# EAGLE board Type-C Test Fixture (TPS65987D)_v2 (EAGLE 9.6.1), part 1 of 2
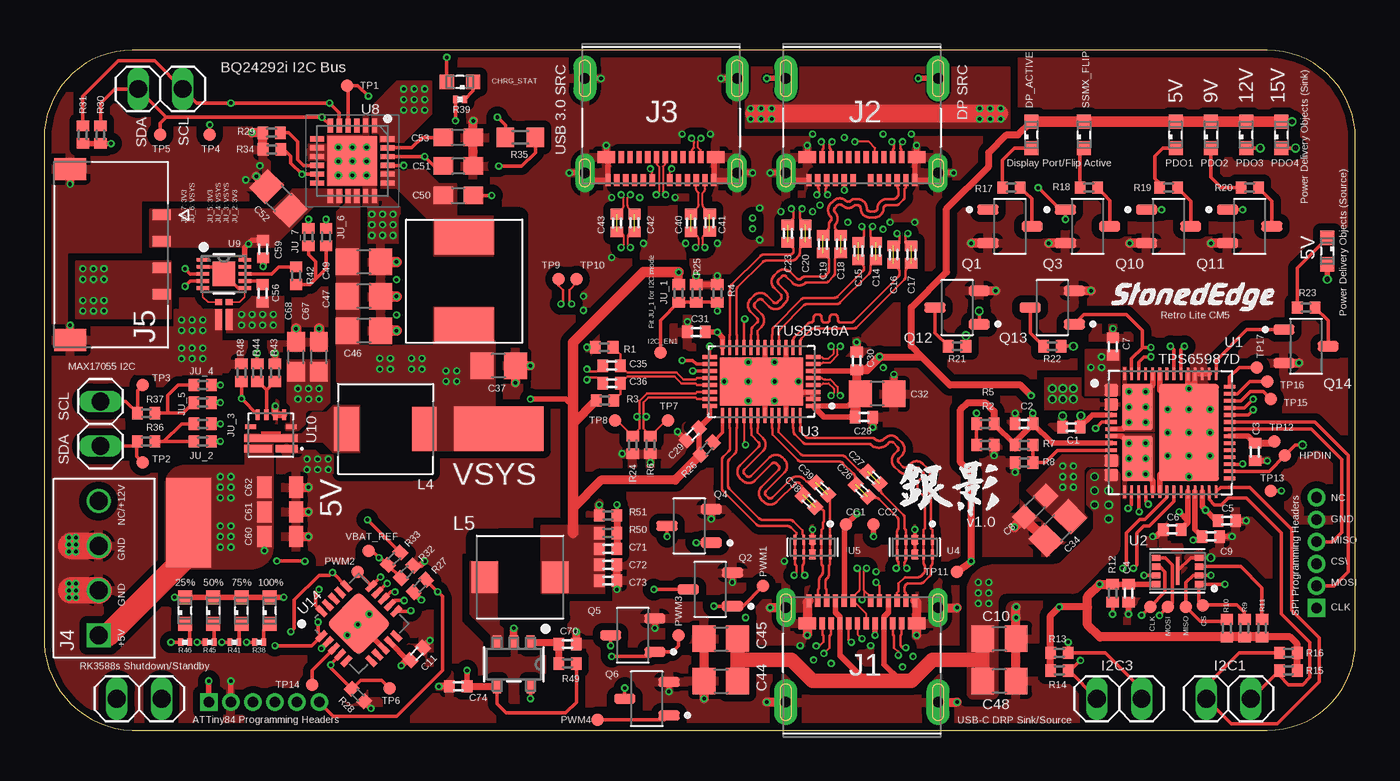
[diagram p2: board, top side]
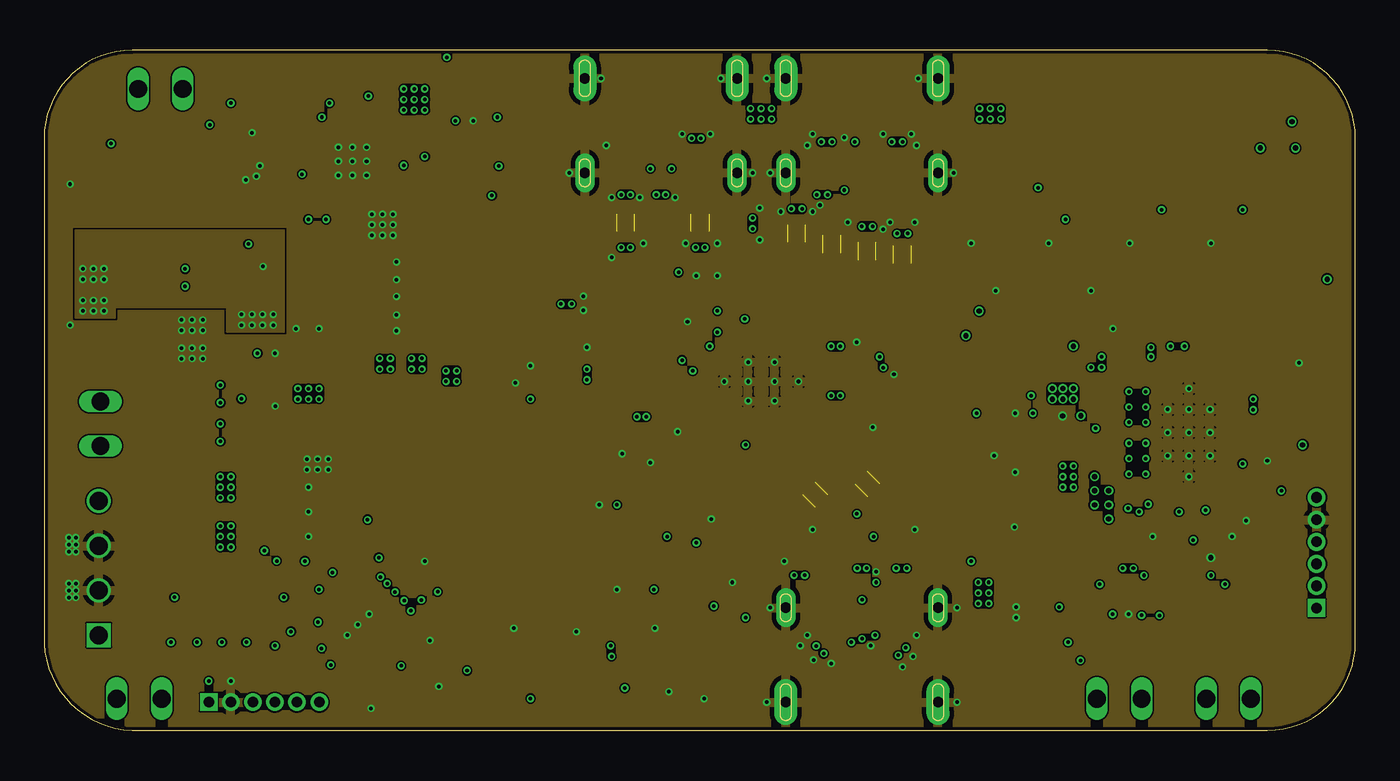
[diagram p3: board, inner layer GND1]
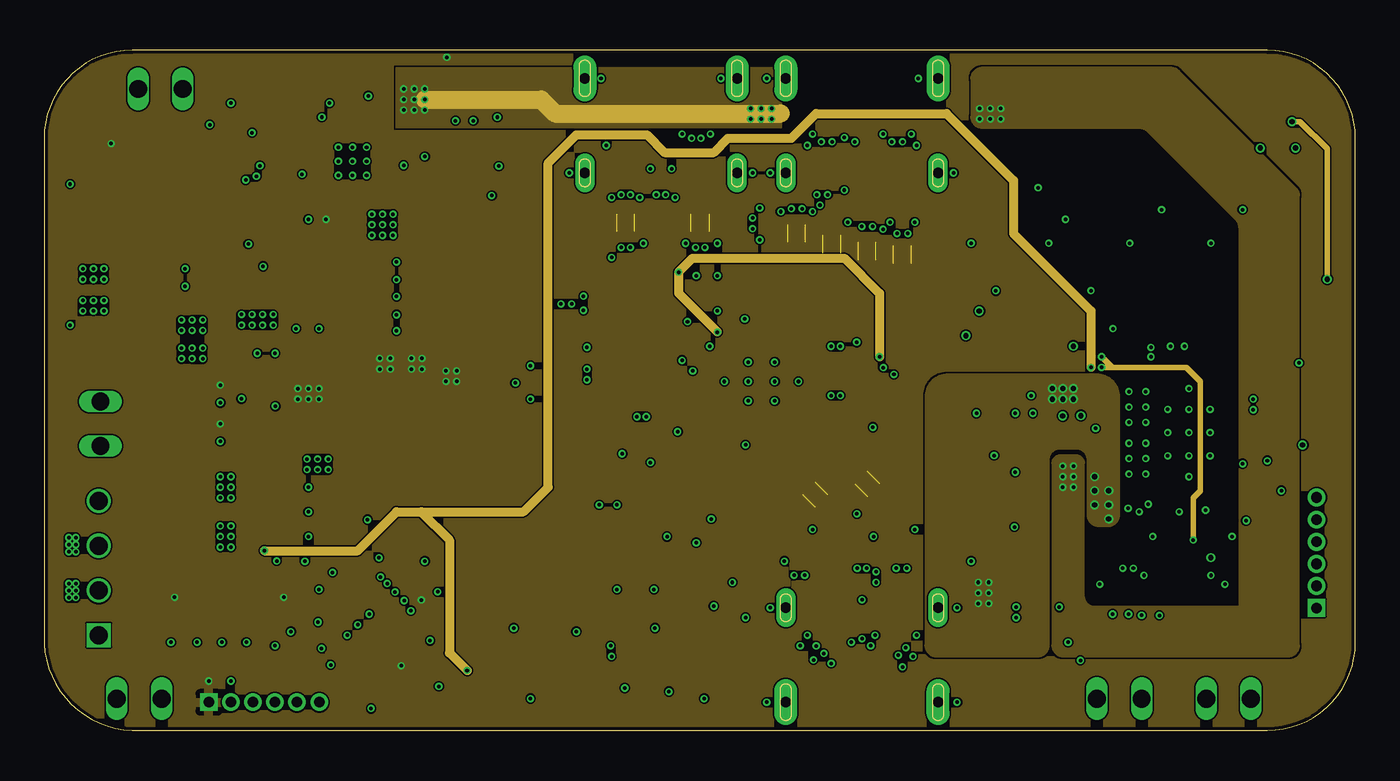
[diagram p4: board, inner layer POWER1]
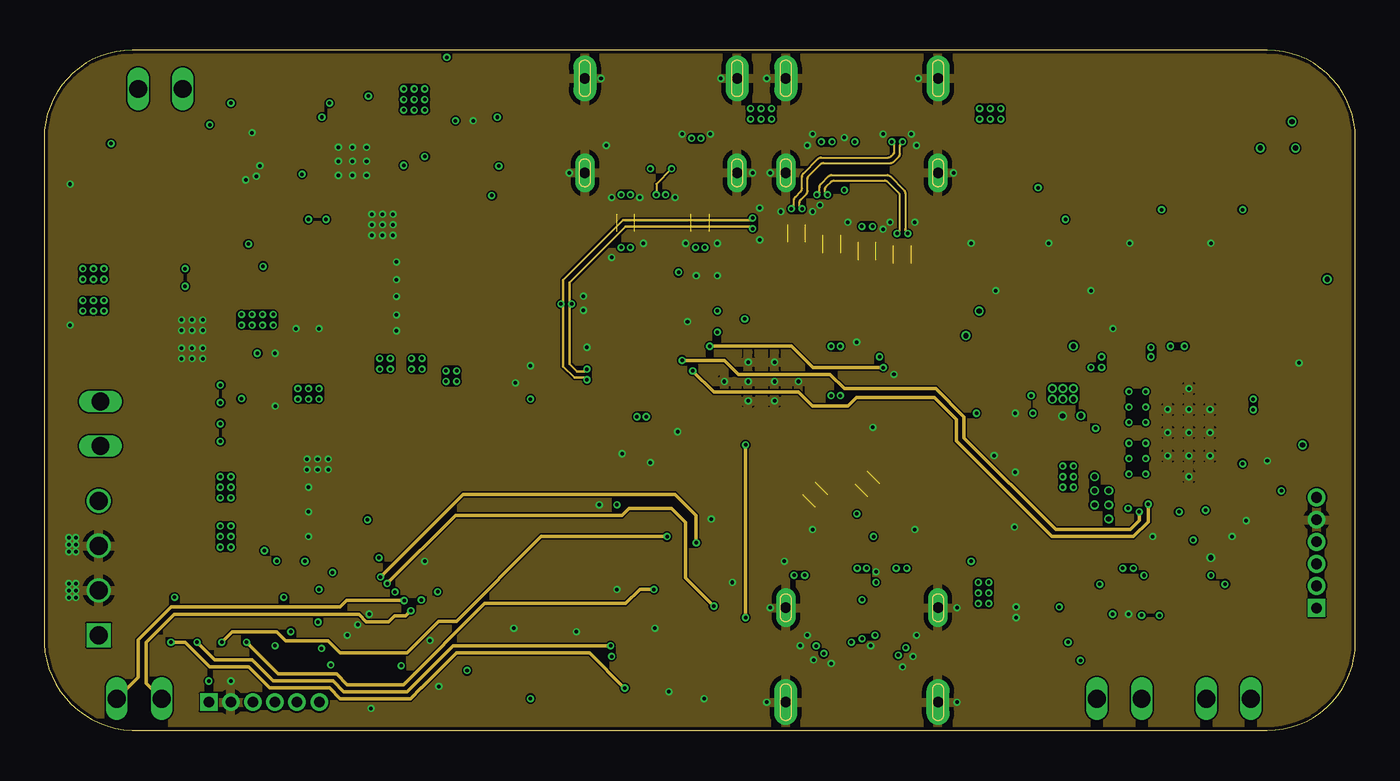
[diagram p5: board, inner layer SIGNAL2]
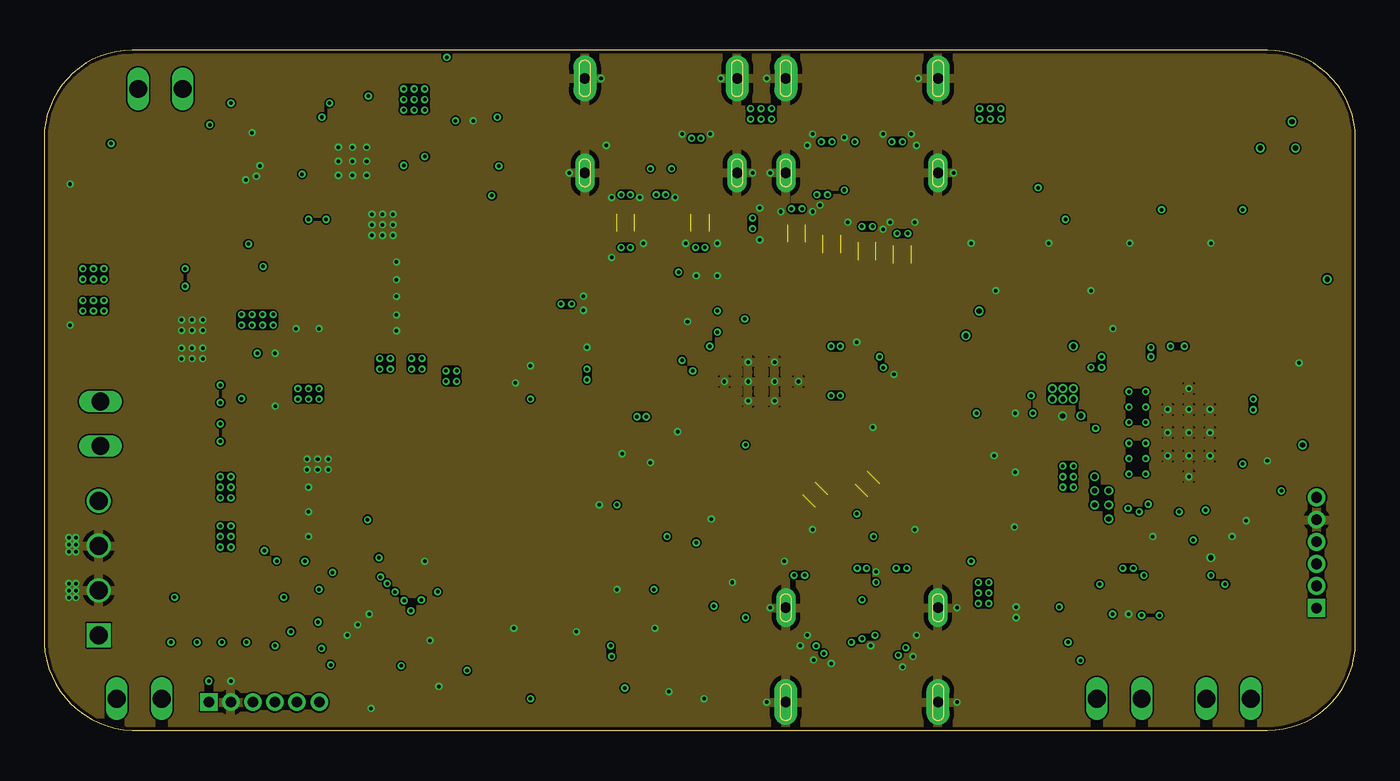
[diagram p6: board, inner layer GND2]
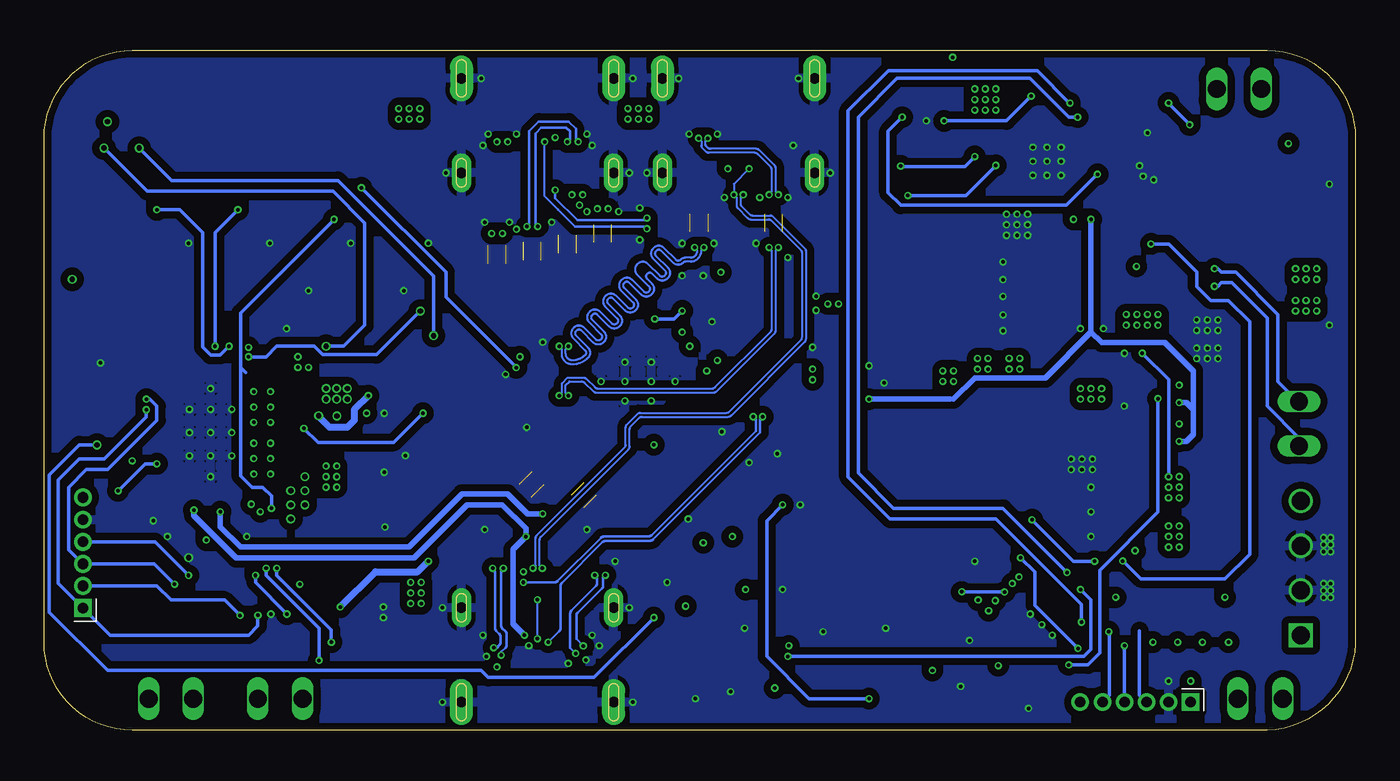
[diagram p7: board, bottom side, seen from below]

Size 74.4 x 38.6 mm. Coordinates in mm from the lower left corner, seen from the top.
Outline: 0,33.6 0,5.4 arc90 5,0 69.4,0 arc90 74.4,5 74.4,33.6 arc90 69.4,38.6 5,38.6 arc90 0,33.6
Copper layers (1+2*3+14*15+16): SIGNAL1 0.035mm / dielectric 0.1164mm / GND1 0.0152mm / dielectric 0.13mm / POWER1 0.0152mm / dielectric 0.2028mm / SIGNAL2 0.0152mm / dielectric 0.13mm / GND2 0.0152mm / dielectric 0.1164mm / SIGNAL3 0.035mm
Design rules "default *": minimum track width 0.09mm, minimum drill 0.2mm, track to track 3.5mil, track to pad 3.5mil, pad to pad 3.5mil, via to via 5mil, smd to smd 0mil, copper to edge 0.2mm, drill to drill 5mil, minimum pad ring 4mil, minimum via ring 4mil, stop-mask expansion 0mil, vias tented up to drill 100mil, thermal gap 10mil
Net classes: 1 USB 1st Layer: width 0.124 mm, clearance 0.102 mm; 2 MIPI 100 Ohm: width 0.124 mm, clearance 0.114 mm; 3 eDP 4th Layer: width 0.113 mm, clearance 0.203 mm; 4 USB 4th Layer: width 0.106 mm, clearance 0.102 mm; 5 eDP 1st Layer: width 0.142 mm, clearance 0.203 mm; 6 USB 6th Layer: width 0.124 mm, clearance 0.102 mm; 7 eDP 6th Layer: width 0.142 mm, clearance 0.203 mm
tRestrict: area 25.8,6.4 to 28,11; area 18,14.6 to 20.7,19.6; area 20.8,14.6 to 22,15.6; area 16.8,14.6 to 17.8,15.6; area 24.4,9.6 to 25.6,11; area 28.2,6.4 to 29.4,7.6; area 20.6,22 to 27,29.2

## Footprints (pad centres in the part's own frame; a part is rotated, then mirrored left to right if it is on the bottom)
SMD2,54-5,08 = smd 2.54 x 5.08: 1 0,0
SML0603 = smd 0.8 x 0.8: A 0.75,0; C -0.75,0
C0402 = smd 0.6 x 0.7: 1 -0.5,0; 2 0.5,0
C0603 = smd 1 x 1: 1 -0.85,0; 2 0.85,0
C0805 = smd 1.3 x 1.5: 1 -0.95,0; 2 0.95,0
C0603' = smd 1.1 x 1: 1 -0.85,0; 2 0.85,0
0805 = smd 0.8 x 1.2: 1 -0.9,0; 2 0.9,0
0603 = smd 1.1 x 1: 1 -0.85,0; 2 0.85,0
TP07R = smd 0.7 x 0.7: TP 0,0
MOLEX_105450-0101 = smd 0.3 x 0.7: A1 -3,3.77; A2 -2.5,3.77; A3 -2,3.77; A4 -1.5,3.77; A5 -1,3.77; A6 -0.5,3.77; A7 0.5,3.77; A8 1,3.77; A9 1.5,3.77; A10 2,3.77; A11 2.5,3.77; A12 3,3.77; B2 2.25,2.47; B3 1.75,2.47; B4 1.25,2.47; B5 0.75,2.47; B6 0.25,2.47; B7 -0.25,2.47; B8 -0.75,2.47; B9 -1.25,2.47; B10 -1.75,2.47; B11 -2.25,2.47 | smd 1 x 0.7: B1 3.1,2.47; B12 -3.1,2.47 | drill 0.6 pad 1.1 long: S1 -4.32,3.36; S2 4.32,3.36 | drill 0.6 pad 1.3 long: S3 -4.32,-2; S4 4.32,-2
TE_640456-4 = drill 1.02 pad 1.37 square: 1 0,0 | drill 1.02 pad 1.37: 2 -2.54,0; 3 -5.08,0; 4 -7.62,0
MOLEX_5040500491 = smd 0.6 x 1: 1 2.25,-2.87; 2 0.75,-2.87; 3 -0.75,-2.87; 4 -2.25,-2.87 | smd 1.25 x 1.8: S1 4.855,2.32; S2 -4.855,2.32
1X02 = drill 1.016 long: 1 -1.27,0; 2 1.27,0
R0402 = smd 0.6 x 0.7: 1 -0.5,0; 2 0.5,0
ASPI-0630HI = smd 2 x 3.4: P$1 -2.5,0; P$2 2.5,0
IND_SPM5020T-1R0M = smd 1.4 x 2.5: 1 -2.2,0; 2 2.2,0
IND_AMDLA4530S-2R2MT = smd 1.5 x 1.8: 1 -2,0; 2 2,0
SOT95P280X125-3N = smd 1.21 x 0.59: 1 -1.255,0.95; 2 -1.255,-0.95; 3 1.255,0
R0603 = smd 1 x 1.1: 1 -0.85,0; 2 0.85,0
R0201 = smd 0.28 x 0.43: 1 -0.255,0; 2 0.255,0
PS0306DRF7T0R01L = smd 0.4 x 1.2: 1 -0.3,-0.075; 4 0.3,-0.075 | smd 0.4 x 0.35: 2 -0.3,0.9; 3 0.3,0.9
IC_TPS65987DDHRSHR = smd 0.8 x 0.7: 1 -3.35,2.4; 3 -3.35,1.6; 11 -3.35,-1.6; 13 -3.35,-2.4 | smd 0.7 x 0.2: 5 -3.35,1; 6 -3.35,0.6; 7 -3.35,0.2; 8 -3.35,-0.2; 9 -3.35,-0.6; 10 -3.35,-1; 29 3.35,-2.6; 30 3.35,-2.2; 31 3.35,-1.8; 32 3.35,-1.4; 33 3.35,-1; 34 3.35,-0.6; 35 3.35,-0.2; 36 3.35,0.2; 37 3.35,0.6; 38 3.35,1; 39 3.35,1.4; 40 3.35,1.8; 41 3.35,2.2; 42 3.35,2.6 | smd 0.2 x 0.7: 15 -2.6,-3.35; 16 -2.2,-3.35; 17 -1.8,-3.35; 18 -1.4,-3.35; 19 -1,-3.35; 20 -0.6,-3.35; 21 -0.2,-3.35; 22 0.2,-3.35; 23 0.6,-3.35; 24 1,-3.35; 25 1.4,-3.35; 26 1.8,-3.35; 27 2.2,-3.35; 28 2.6,-3.35; 43 2.6,3.35; 44 2.2,3.35; 45 1.8,3.35; 46 1.4,3.35; 47 1,3.35; 48 0.6,3.35; 49 0.2,3.35; 50 -0.2,3.35; 51 -0.6,3.35; 52 -1,3.35; 53 -1.4,3.35; 54 -1.8,3.35; 55 -2.2,3.35; 56 -2.6,3.35 | smd 1.75 x 2.6: 57 -1.875,1.45 | drill 0.2 pad 0.4: 57_1 -2.35,2.325; 57_2 -2.35,1.45; 57_3 -2.35,0.575; 57_4 -1.4,0.575; 57_5 -1.4,1.45; 57_6 -1.4,2.325; 58_1 -2.35,-0.6; 58_2 -2.35,-1.475; 58_3 -2.35,-2.35; 58_4 -1.4,-2.35; 58_5 -1.4,-1.475; 58_6 -1.4,-0.6; 59_1 -0.15,1.32; 59_2 -0.15,0; 59_3 -0.15,-1.32; 59_4 1.05,-2.5; 59_5 1.05,-1.32; 59_6 1.05,0; 59_7 1.05,1.32; 59_8 1.05,2.5; 59_9 2.25,1.32; 59_10 2.25,0; 59_11 2.25,-1.32 | smd 1.75 x 2.55: 58 -1.875,-1.475 | smd 3.4 x 5.5: 59 1.05,0
PSON50P300X200X60-9N = smd 0.49 x 0.35: 1 -1.22,0.75; 2 -1.22,0.25; 3 -1.22,-0.25; 4 -1.22,-0.75; 5 1.22,-0.75; 6 1.22,-0.25; 7 1.22,0.25; 8 1.22,0.75 | smd 0.2 x 1.6: 9 0,0
QFN40P400X600X80-41N = smd 0.86 x 0.22: 1 -2.935,1.4; 2 -2.935,1; 3 -2.935,0.6; 4 -2.935,0.2; 5 -2.935,-0.2; 6 -2.935,-0.6; 7 -2.935,-1; 8 -2.935,-1.4; 21 2.935,-1.4; 22 2.935,-1; 23 2.935,-0.6; 24 2.935,-0.2; 25 2.935,0.2; 26 2.935,0.6; 27 2.935,1; 28 2.935,1.4 | smd 0.22 x 0.86: 9 -2.2,-1.935; 10 -1.8,-1.935; 11 -1.4,-1.935; 12 -1,-1.935; 13 -0.6,-1.935; 14 -0.2,-1.935; 15 0.2,-1.935; 16 0.6,-1.935; 17 1,-1.935; 18 1.4,-1.935; 19 1.8,-1.935; 20 2.2,-1.935; 29 2.2,1.935; 30 1.8,1.935; 31 1.4,1.935; 32 1,1.935; 33 0.6,1.935; 34 0.2,1.935; 35 -0.2,1.935; 36 -0.6,1.935; 37 -1,1.935; 38 -1.4,1.935; 39 -1.8,1.935; 40 -2.2,1.935 | smd 4.7 x 2.7: 41 0,0 | drill 0.2 pad 0.4: 42 -0.75,1.1; 43 0.75,1.1; 44 -2.1,0; 45 -0.75,0; 46 0.75,0; 47 2.1,0; 48 -0.75,-1.1; 49 0.75,-1.1
IC_TPD4E05U06DQAR = smd 0.565 x 0.2: 1 -0.417,1; 2 -0.417,0.5; 4 -0.417,-0.5; 5 -0.417,-1; 6 0.417,-1; 7 0.417,-0.5; 9 0.417,0.5; 10 0.417,1 | smd 0.565 x 0.4: 3 -0.417,0; 8 0.417,0
QFN50P400X400X100-25N = smd 0.8 x 0.3: 1 -2,1.25; 2 -2,0.75; 3 -2,0.25; 4 -2,-0.25; 5 -2,-0.75; 6 -2,-1.25; 13 2,-1.25; 14 2,-0.75; 15 2,-0.25; 16 2,0.25; 17 2,0.75; 18 2,1.25 | smd 0.3 x 0.8: 7 -1.25,-2; 8 -0.75,-2; 9 -0.25,-2; 10 0.25,-2; 11 0.75,-2; 12 1.25,-2; 19 1.25,2; 20 0.75,2; 21 0.25,2; 22 -0.25,2; 23 -0.75,2; 24 -1.25,2 | smd 2.8 x 2.8: 25 0,0
21-100013A_T102A2+1C_MXM = smd 0.711 x 0.203: 1 -1.194,0.8; 2 -1.194,0.4; 3 -1.194,0; 4 -1.194,-0.4; 5 -1.194,-0.8; 6 1.194,-0.8; 7 1.194,-0.4; 8 1.194,0; 9 1.194,0.4; 10 1.194,0.8 | smd 1.295 x 1.397: 11 0,0
CONV_TPS61235PRWLT = smd 1.24 x 0.44: 1 -0.9,0.77 | smd 3.04 x 0.44: 2 0,0.17 | smd 0.6 x 0.25: 3 -1.15,-0.475; 8 1.15,-0.475 | smd 0.25 x 0.6: 4 -0.75,-1.15; 5 -0.25,-1.15; 6 0.25,-1.15; 7 0.75,-1.15 | smd 1.59 x 0.44: 9 0.725,0.77
SY8089AAAC_SGY-L = smd 0.8 x 0.457: 1 -1.251,0.95; 2 -1.251,0; 3 -1.251,-0.95; 4 1.251,-0.95; 5 1.251,0.95
QFN20G-0.5-4X4MM = smd 0.7 x 0.3: 1 -2,1; 2 -2,0.5; 3 -2,0; 4 -2,-0.5; 5 -2,-1; 11 2,-1; 12 2,-0.5; 13 2,0; 14 2,0.5; 15 2,1 | smd 0.3 x 0.7: 6 -1,-2; 7 -0.5,-2; 8 0,-2; 9 0.5,-2; 10 1,-2; 16 1,2; 17 0.5,2; 18 0,2; 19 -0.5,2; 20 -1,2 | smd 2.6 x 2.6: PAD 0,0
1MM_PIC-PROGRAMING_HEADER = drill 0.6 pad 1 square: 1 -1.25,1 | drill 0.6 pad 1: 2 0,1; 3 1.25,1; 4 2.5,1; 5 3.75,1; 6 5.02,1

## Placement (x,y rotation side)
5V  [SMD2,54-5,08]  8.2,11.8 0 top
25%  [SML0603]  8,6.8 90 top
50%  [SML0603]  9.6,6.8 90 top
75%  [SML0603]  11.2,6.8 90 top
100%  [SML0603]  12.8,6.8 90 top
C1  10uF  [C0402]  58.28,17.21 0 top
C2  10uF  [C0402]  55.6,17.4 0 top
C3  4.7uF  [C0402]  68.7,15.8 90 top
C4  0.1uF  [C0402]  61.53,7.79 90 top
C5  220pF  [C0402]  67.1,11.9 180 top
C6  220pF  [C0402]  64,11.4 0 top
C7  10uF  [C0402]  60.64,21.78 90 top
C8  47uF  [C0603]  56.22,12.71 225 top
C9  22uF  [C0402]  66.2,11 180 top
C10  10nF  [C0805]  54.2,5.2 180 top
C11  0.1uF  [C0402]  21.14,4.34 225 top
C14  100nF  [C0402]  47.2,27.2 90 top
C15  100nF  [C0402]  46.2,27.2 90 top
C16  100nF  [C0402]  48.2,27 90 top
C17  100nF  [C0402]  49.2,27 90 top
C18  100nF  [C0402]  45.2,27.6 90 top
C19  100nF  [C0402]  44.2,27.6 90 top
C20  100nF  [C0402]  43.2,28.2 90 top
C23  100nF  [C0402]  42.2,28.2 90 top
C26  220nF  [C0402]  46.4,13.6 135 top
C27  220nF  [C0402]  47.06,14.34 135 top
C28  100nF  [C0402]  46.52,17.78 180 top
C29  100nF  [C0402]  36.8,16.8 45 top
C30  100nF  [C0402]  46.1,20.97 270 top
C31  100nF  [C0402]  37,22.62 0 top
C32  10uF  [C0805]  47.27,19.1 180 top
C34  1µF  [C0805]  57.5,11.47 45 top
C35  100nF  [C0402]  32.2,20.7 0 top
C36  100nF  [C0402]  32.2,19.7 0 top
C37  10µF  [C0805]  25.79,20.69 180 top
C38  220nF  [C0402]  43.4,13 135 top
C39  220nF  [C0402]  44.13,13.72 135 top
C40  100nF  [C0402]  36.7,28.8 90 top
C41  100nF  [C0402]  37.76,28.81 90 top
C42  100nF  [C0402]  33.5,28.8 270 top
C43  100nF  [C0402]  32.5,28.8 270 top
C44  10nF  [C0805]  38.4,2.8 0 top
C45  10nF  [C0805]  38.4,5.2 0 top
C46  10µF  [C0805]  18.15,22.68 180 top
C47  10µF  [C0805]  18.15,24.63 180 top
C48  10nF  [C0805]  54.2,2.8 180 top
C49  10µF  [C0805]  18.15,26.58 180 top
C50  0.047µF  [C0603']  23.5,30.36 0 top
C51  1uF  [C0603']  23.5,32.03 180 top
C52  10µF  [C0805]  13.3,30.19 315 top
C53  1uF  [C0603']  23.5,33.65 180 top
C56  0.47uF  [C0402]  12.4,24.8 270 top
C59  0.1uF  [C0402]  12.43,27.31 270 top
C60  22uF  [0805]  13.4,11 0 top
C61  22uF  [0805]  13.4,12.4 0 top
C62  22uF  [0805]  13.4,13.8 0 top
C67  1.0uF  [0603]  15.6,21.2 90 top
C68  10uF  [0603]  14.3,21.2 90 top
C70  0.1uF  [C0402]  29.7,4.9 0 top
C71  100pF  [C0402]  32,10.3 0 top
C72  10uF  [C0402]  32,9.4 0 top
C73  100nF  [C0402]  32,8.5 0 top
C74  10uF  [C0402]  23.5,2.5 180 top
CC3  PTR1TP07R  [TP07R]  45.51,11.68 0 top
CC4  PTR1TP07R  [TP07R]  47.06,11.68 0 top
CHRG_STAT  [SML0603]  23.6,36.8 180 top
CLK  PTR1TP07R  [TP07R]  62.75,7.01 90 top
CS  PTR1TP07R  [TP07R]  65.75,7.09 0 top
HPDIN  PTR1TP07R  [TP07R]  70.4,15.6 180 top
I2C_EN1  PTR1TP07R  [TP07R]  34.96,21.45 0 top
J1  105450-0101  [MOLEX_105450-0101]  46.4,3.6 0 top
J2  105450-0101  [MOLEX_105450-0101]  46.4,35 180 top
J3  105450-0101  [MOLEX_105450-0101]  35,35 180 top
J4  640456-4  [TE_640456-4]  3.1,5.4 270 top
J5  5040500491  [MOLEX_5040500491]  3.8,27 90 top
JP1  [1X02]  6.6,36.4 180 top
JP2  [1X02]  3.2,17.4 270 top
JP3  [1X02]  61,1.8 180 top
JP4  [1X02]  67.2,1.8 0 top
JP5  [1X02]  5.4,1.8 0 top
JU_1  0  [R0402]  36,24.8 90 top
JU_2  0  [R0402]  9,16.4 180 top
JU_3  0  [R0402]  9,17.4 180 top
JU_4  0  [R0402]  9,19.6 180 top
JU_5  0  [R0402]  9,18.6 180 top
JU_6  0  [R0402]  16,28 270 top
JU_7  0  [R0402]  15,28 270 top
L1  ASPI-0630HI  [ASPI-0630HI]  23.84,25.5 270 top
L4  1uH  [IND_SPM5020T-1R0M]  19.37,17.11 0 top
L5  AMDLA4530S-2R2MT  [IND_AMDLA4530S-2R2MT]  27,8.7 0 top
MISO  PTR1TP07R  [TP07R]  64.79,7.01 90 top
MOSI  PTR1TP07R  [TP07R]  63.77,7.01 270 top
PDO1  [SML0603]  64.2,33.8 90 top
PDO1_SRC1  [SML0603]  72.8,27.2 270 top
PDO2  [SML0603]  66.2,33.8 90 top
PDO3  [SML0603]  68.2,33.8 90 top
PDO4  [SML0603]  70.2,33.8 90 top
PWM1  TPSQTP07R  [TP07R]  40.8,8.2 0 top
PWM2  TPSQTP07R  [TP07R]  17.8,9 0 top
PWM3  TPSQTP07R  [TP07R]  36,5.4 0 top
PWM4  TPSQTP07R  [TP07R]  31.4,0.6 0 top
Q1  AO3400A  [SOT95P280X125-3N]  54.8,28.6 0 top
Q2  AO3400A  [SOT95P280X125-3N]  37.8,8 180 top
Q3  AO3400A  [SOT95P280X125-3N]  59.2,28.6 0 top
Q4  AO3400A  [SOT95P280X125-3N]  36.6,11.6 180 top
Q5  AO3400A  [SOT95P280X125-3N]  33.4,5.4 180 top
Q6  AO3400A  [SOT95P280X125-3N]  34.2,1.8 180 top
Q10  AO3400A  [SOT95P280X125-3N]  63.8,28.6 0 top
Q11  AO3400A  [SOT95P280X125-3N]  68.4,28.6 0 top
Q12  AO3400A  [SOT95P280X125-3N]  51.8,24 180 top
Q13  AO3400A  [SOT95P280X125-3N]  57.2,24 180 top
Q14  AO3400A  [SOT95P280X125-3N]  71.6,21.8 0 top
R1  100K  [R0402]  31.78,21.74 0 top
R2  100k 1%  [R0402]  53.4,16.2 180 top
R3  100K  [R0402]  31.82,18.72 0 top
R4  10K  [R0402]  38.2,24.8 270 top
R5  10k 1%  [R0402]  53.4,17.4 0 top
R6  2M  [R0402]  34.4,16.2 90 top
R7  100k 1%  [R0402]  55.6,16.2 180 top
R8  100k 1%  [R0402]  55.6,15.2 0 top
R9  3.3k  [R0402]  68.1,5.8 270 top
R10  3.3k  [R0402]  67.1,5.8 270 top
R11  3.3k  [R0402]  69.1,5.8 270 top
R12  3.3k  [R0402]  60.62,7.79 90 top
R13  4.7k  [R0402]  57.6,4.4 180 top
R14  4.7k  [R0402]  57.6,3.4 180 top
R15  4.7k  [R0402]  70.6,3.4 0 top
R16  4.7k  [R0402]  70.6,4.4 0 top
R17  10k  [R0402]  54.87,30.8 180 top
R18  10k  [R0402]  59.27,30.8 180 top
R19  10k  [R0402]  63.8,30.8 180 top
R20  10k  [R0402]  68.4,30.8 180 top
R21  10k  [R0402]  51.8,21.8 0 top
R22  10k  [R0402]  57.2,21.8 0 top
R23  10k  [R0402]  71.6,24 180 top
R24  2M  [R0402]  33.4,16.2 90 top
R25  10k  [R0402]  37,24.8 270 top
R26  10K  [R0402]  37.6,16 45 top
R27  4.7k  [R0402]  21.32,8.2 45 top
R28  10k  [R0402]  17.8,2 135 top
R29  261Ω  [R0402]  12.91,33.91 0 top
R30  4.7k  [R0402]  3.2,33.8 90 top
R31  4.7k  [R0402]  2.2,33.8 90 top
R32  10k  [R0402]  20.6,9 225 top
R33  27.4k  [R0402]  19.86,9.74 45 top
R34  10kΩ  [R0402]  12.93,32.97 0 top
R35  10kΩ  [R0603]  27.02,33.65 0 top
R36  4.7k  [R0402]  5.8,16.4 180 top
R37  4.7k  [R0402]  5.8,18 180 top
R38  10k  [R0201]  12.2,5 0 top
R39  2.2k  [R0201]  23.6,35.8 0 top
R40  PS0306DRF7T0R01L  [PS0306DRF7T0R01L]  10.2,23.4 0 top
R41  10k  [R0201]  10.8,5 0 top
R42  4.7k  [R0402]  14.3,25.8 90 top
R43  332k  [R0402]  13.1,20.3 90 top
R44  1M  [R0402]  12.1,20.3 90 top
R45  10k  [R0201]  9.4,5 0 top
R46  10k  [R0201]  8,5 0 top
R48  1M  [R0402]  11.2,20.3 270 top
R49  10k  [R0402]  29.7,3.8 0 top
R50  232k  [R0402]  32,11.2 180 top
R51  51k  [R0402]  32,12.2 0 top
SSMX_DP_ACTIVE1  [SML0603]  56.01,33.8 90 top
SSMX_FLIP_ACTIVE1  SSMX_FLIP  [SML0603]  59,33.8 90 top
TP1  TPSQTP07R  [TP07R]  17.2,36.6 0 top
TP2  TPSQTP07R  [TP07R]  5.6,15.2 0 top
TP3  TPSQTP07R  [TP07R]  5.6,19.6 0 top
TP4  TPSQTP07R  [TP07R]  9.4,33.8 0 top
TP5  TPSQTP07R  [TP07R]  6.6,33.8 0 top
TP6  TPSQTP07R  [TP07R]  19.6,2.4 0 top
TP7  TPSQTP07R  [TP07R]  35.4,17.6 0 top
TP8  TPSQTP07R  [TP07R]  32.4,17.6 0 top
TP9  TPSQTP07R  [TP07R]  29.2,25.6 0 top
TP10  TPSQTP07R  [TP07R]  30.2,25.6 0 top
TP11  TPSQTP07R  [TP07R]  51.8,9 0 top
TP12  TPSQTP07R  [TP07R]  69.8,16.4 0 top
TP13  TPSQTP07R  [TP07R]  69.6,13.6 0 top
TP14  TPSQTP07R  [TP07R]  15.2,2.6 0 top
TP15  TPSQTP07R  [TP07R]  69.6,18.8 0 top
TP16  TPSQTP07R  [TP07R]  69.4,19.8 0 top
TP17  TPSQTP07R  [TP07R]  68.8,20.6 0 top
U1  TPS65987DDHRSHR  [IC_TPS65987DDHRSHR]  63.9,16.9 0 top
U2  W25X05CLUXIGTR  [PSON50P300X200X60-9N]  64.3,9.05 180 top
U3  TUSB546-DCIRNQT  [QFN40P400X600X80-41N]  40.7,19.8 180 top
U4  TPD4E05U06DQAR  [IC_TPD4E05U06DQAR]  49.4,10.4 270 top
U5  TPD4E05U06DQAR  [IC_TPD4E05U06DQAR]  43.6,10.4 270 top
U8  BQ24292I  [QFN50P400X400X100-25N]  17.5,32.31 270 top
U9  MAX17055ETB+T  [21-100013A_T102A2+1C_MXM]  10.2,25.9 0 top
U10  TPS61235PRWLT  [CONV_TPS61235PRWLT]  12.87,16.75 180 top
U13  SY8089AAACSY8089AAAC_SGY-L  [SY8089AAAC_SGY-L]  26.65,3.75 270 top
U14  MCU-ATTINY84A-MU(QFN20)  [QFN20G-0.5-4X4MM]  17.86,6.06 45 top
U$3  6PINEADER  [1MM_PIC-PROGRAMING_HEADER]  73.2,8.2 90 top
U$5  6PINEADER  [1MM_PIC-PROGRAMING_HEADER]  10.6,0.6 0 top
VBAT_REF  TPSQTP07R  [TP07R]  18.4,10.2 0 top
VSYS  [SMD2,54-5,08]  25.81,17.12 90 top